# EAGLE design SmoothiePanel (EAGLE 6.4)
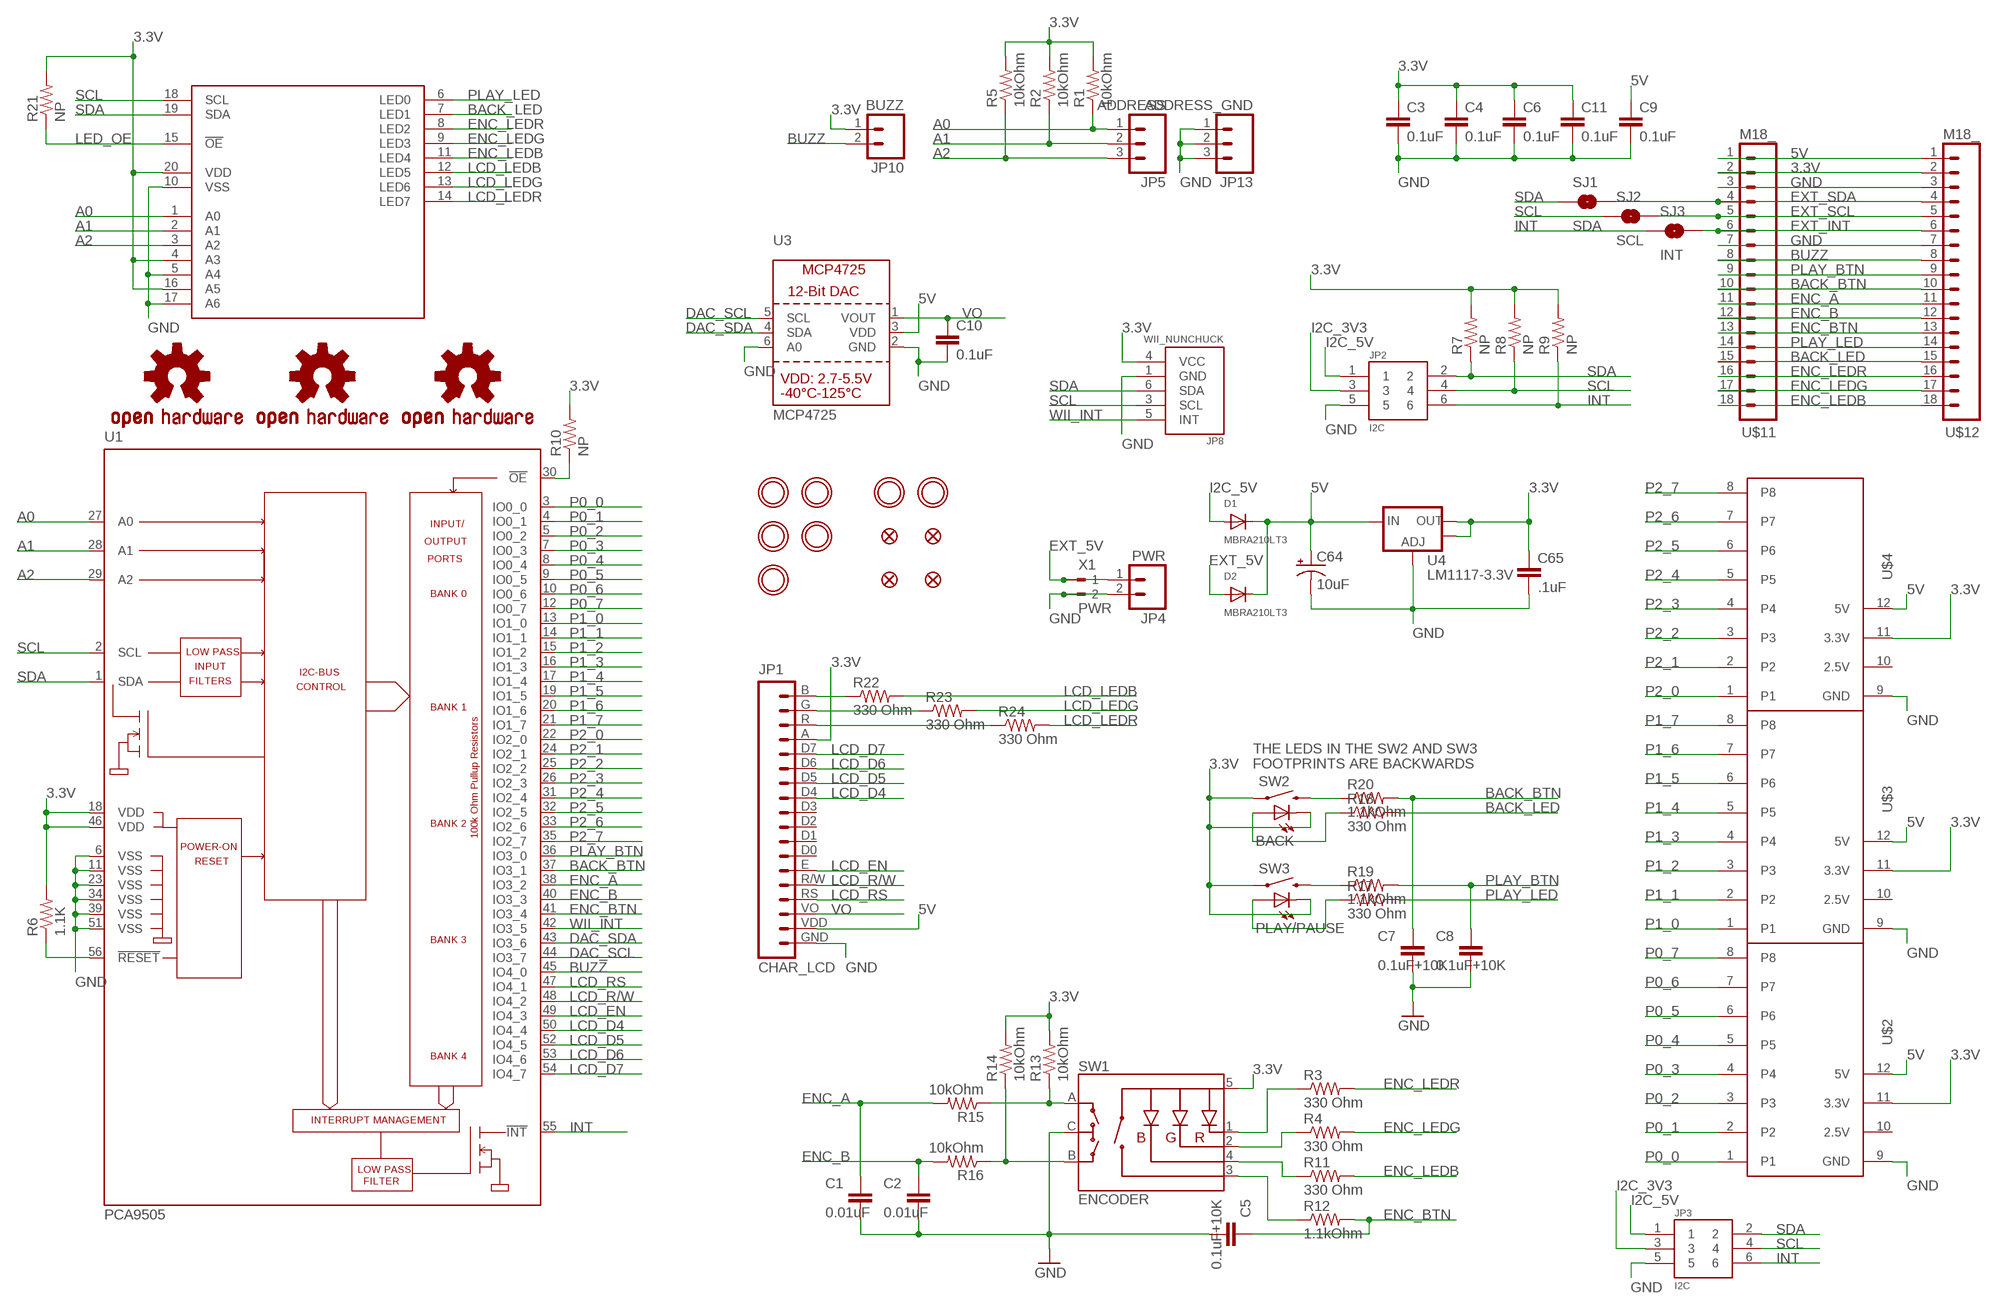
[diagram p0: schematic, sheet 1]

## Parts
C1  0.01uF  C-EUC0603  [C0603]
C2  0.01uF  C-EUC0603  [C0603]
C3  0.1uF  CAP0603-CAP  [0603-CAP]
C4  0.1uF  CAP0603-CAP  [0603-CAP]
C5  0.1uF+10K  C-EUC0603  [C0603]
C6  0.1uF  CAP0603-CAP  [0603-CAP]
C7  0.1uF+10K  C-EUC0603  [C0603]
C8  0.1uF+10K  C-EUC0603  [C0603]
C9  0.1uF  CAP0603-CAP  [0603-CAP]
C10  0.1uF  CAP0603-CAP  [0603-CAP]
C11  0.1uF  CAP0603-CAP  [0603-CAP]
C64  10uF  CAP_POL1206  [EIA3216]
C65  .1uF  C-EUC0603  [C0603]
D1  MBRA210LT3  DIODESMA  [SMADIODE]
D2  MBRA210LT3  DIODESMA  [SMADIODE]
JP1  CHAR_LCD  LCD_TEXT  [TEXT_LCD]
JP2  I2C  M03X2  [2X3-SHROUDED]
JP3  I2C  M03X2  [2X3-SHROUDED]
JP4  PWR  M02PTH3  [1X02_LONGPADS]
JP5  ADDRESS  M03PTH  [1X03]
JP8  WII_NUNCHUCK  [WII_NUNCHUCK]
JP9  FIDUCIAL1X2  [FIDUCIAL-1X2]
JP10  BUZZ  M02PTH4  [1X02_XTRA_BIG]
JP11  FIDUCIAL1X2  [FIDUCIAL-1X2]
JP12  FIDUCIAL1X2  [FIDUCIAL-1X2]
JP13  ADDRESS_GND  M03PTH  [1X03]
JP14  FIDUCIAL1X2  [FIDUCIAL-1X2]
R1  10kOhm  R-US_R0603  [R0603]
R2  10kOhm  R-US_R0603  [R0603]
R3  330 Ohm  R-US_R0603  [R0603]
R4  330 Ohm  R-US_R0603  [R0603]
R5  10kOhm  R-US_R0603  [R0603]
R6  1.1K  R-US_R0603  [R0603]
R7  NP  R-US_R0603  [R0603]
R8  NP  R-US_R0603  [R0603]
R9  NP  R-US_R0603  [R0603]
R10  NP  R-US_R0603  [R0603]
R11  330 Ohm  R-US_R0603  [R0603]
R12  1.1kOhm  R-US_R0603  [R0603]
R13  10kOhm  R-US_R0603  [R0603]
R14  10kOhm  R-US_R0603  [R0603]
R15  10kOhm  R-US_R0603  [R0603]
R16  10kOhm  R-US_R0603  [R0603]
R17  330 Ohm  R-US_R0603  [R0603]
R18  330 Ohm  R-US_R0603  [R0603]
R19  1.1kOhm  R-US_R0603  [R0603]
R20  1.1kOhm  R-US_R0603  [R0603]
R21  NP  R-US_R0603  [R0603]
R22  330 Ohm  R-US_R0603  [R0603]
R23  330 Ohm  R-US_R0603  [R0603]
R24  330 Ohm  R-US_R0603  [R0603]
SJ1  SDA  SOLDERJUMPERNO  [SJ_2S-NO]
SJ2  SCL  SOLDERJUMPERNO  [SJ_2S-NO]
SJ3  INT  SOLDERJUMPERNO  [SJ_2S-NO]
SW1  ENCODER  ENCODER_RGB_CA  [ENCODER_LED_3]
SW2  BACK  SWITCH-MOMENTARY-LEDPTH  [TACTILE-PTH-LED-12MM]
SW3  PLAY/PAUSE  SWITCH-MOMENTARY-LEDPTH  [TACTILE-PTH-LED-12MM]
U1  PCA9505  [TSSOP56-6]
U2  PCA9634-TSSOP20  [TSSOP20]
U3  MCP4725  DAC_MCP4725  [SOT23-6]
U4  LM1117-3.3V  V_REG_LM1117SOT223  [SOT223]
U$1  OSHW-LOGOL  [OSHW-LOGO-L]
U$2  PAPILIO-WING-8BITS  [PAPILIO-WING-8BITS]
U$3  PAPILIO-WING-8BITS  [PAPILIO-WING-8BITS]
U$4  PAPILIO-WING-8BITS  [PAPILIO-WING-8BITS]
U$5  MOUNTINGHOLE3.0THIN  [MOUNTINGHOLE_3.0_PLATEDTHIN]
U$6  MOUNTINGHOLE2.5_THICK  [MOUNTINGHOLE_2.5_PLATED_THICK]
U$7  MOUNTINGHOLE2.5_THICK  [MOUNTINGHOLE_2.5_PLATED_THICK]
U$8  OSHW-LOGOL  [OSHW-LOGO-L]
U$9  MOUNTINGHOLE3.0THIN  [MOUNTINGHOLE_3.0_PLATEDTHIN]
U$10  OSHW-LOGOL  [OSHW-LOGO-L]
U$11  M18_  [1X18]
U$12  M18_  [1X18]
U$13  MOUNTINGHOLE3.0THIN  [MOUNTINGHOLE_3.0_PLATEDTHIN]
U$14  MOUNTINGHOLE3.0THIN  [MOUNTINGHOLE_3.0_PLATEDTHIN]
U$15  MOUNTINGHOLE3.0THIN  [MOUNTINGHOLE_3.0_PLATEDTHIN]
X1  PWR  180-2  [180-2]

## Nets
3.3V: C3.1 C4.1 C6.1 C11.1 C65.1 JP1.A JP8.4(VCC) JP10.1 R1.2 R2.2 R5.2 R6.2 R7.2 R8.2 R9.2 R10.2 R13.2 R14.2 R21.2 SW1.5(+) SW2.4 SW2.C SW3.4 SW3.C U1.18(VDD) U1.46(VDD) U2.4(A3) U2.16(A5) U2.20(VDD) U4.2(OUT) U4.4(OUT) U$2.11(3.3V) U$3.11(3.3V) U$4.11(3.3V) U$11.2 U$12.2
5V: C9.1 C64.A(+) D1.C D2.C JP1.VDD U3.3(VDD) U4.3(IN) U$2.12(5V) U$3.12(5V) U$4.12(5V) U$11.1 U$12.1
A0: JP5.1 R1.1 U1.27(A0) U2.1(A0)
A1: JP5.2 R2.1 U1.28(A1) U2.2(A1)
A2: JP5.3 R5.1 U1.29(A2) U2.3(A2)
BACK_BTN: C7.1 R20.2 U1.37(IO3_1) U$11.10 U$12.10
BACK_BTN_RES: R20.1 SW2.2
BACK_LED: R18.2 U2.7(LED1) U$11.15 U$12.15
BACK_LED_RES: R18.1 SW2.A
BUZZ: JP10.2 U1.45(IO4_0) U$11.8 U$12.8
DAC_SCL: U1.44(IO3_7) U3.5(SCL)
DAC_SDA: U1.43(IO3_6) U3.4(SDA)
ENC_A: C1.1 R15.2 U1.38(IO3_2) U$11.11 U$12.11
ENC_A_RES: R13.1 R15.1 SW1.A
ENC_B: C2.1 R16.2 U1.40(IO3_3) U$11.12 U$12.12
ENC_B_RES: R14.1 R16.1 SW1.B
ENC_BTN: C5.1 R12.2 U1.41(IO3_4) U$11.13 U$12.13
ENC_BTN_RES: R12.1 SW1.3(SW)
ENC_LEDB: R11.2 U2.11(LED4) U$11.18 U$12.18
ENC_LEDB_RES: R11.1 SW1.4(-B)
ENC_LEDG: R4.2 U2.9(LED3) U$11.17 U$12.17
ENC_LEDG_RES: R4.1 SW1.2(-G)
ENC_LEDR: R3.2 U2.8(LED2) U$11.16 U$12.16
ENC_LEDR_RES: R3.1 SW1.1(-R)
EXT_5V: D2.A JP4.1 X1.1
EXT_INT: SJ3.2 U$11.6 U$12.6
EXT_SCL: SJ2.2 U$11.5 U$12.5
EXT_SDA: SJ1.2 U$11.4 U$12.4
GND: C1.2 C2.2 C3.2 C4.2 C5.2 C6.2 C7.2 C8.2 C9.2 C10.2 C11.2 C64.C(-) C65.2 JP1.GND JP2.5 JP3.5 JP4.2 JP8.1(GND) JP13.1 JP13.2 JP13.3 SW1.C U1.6(VSS) U1.11(VSS) U1.23(VSS) U1.34(VSS) U1.39(VSS) U1.51(VSS) U2.5(A4) U2.10(VSS) U2.17(A6) U3.2(GND) U3.6(A0) U4.1(ADJ) U$2.9(GND) U$3.9(GND) U$4.9(GND) U$11.3 U$11.7 U$12.3 U$12.7 X1.2
I2C_3V3: JP2.3 JP3.3
I2C_5V: D1.A JP2.1 JP3.1
INT: JP2.6 JP3.6 R9.1 SJ3.1 U1.55(!INT)
LCD_D4: JP1.D4 U1.50(IO4_4)
LCD_D5: JP1.D5 U1.52(IO4_5)
LCD_D6: JP1.D6 U1.53(IO4_6)
LCD_D7: JP1.D7 U1.54(IO4_7)
LCD_EN: JP1.E U1.49(IO4_3)
LCD_LEDB: R22.2 U2.12(LED5)
LCD_LEDB_RES: JP1.B R22.1
LCD_LEDG: R23.2 U2.13(LED6)
LCD_LEDG_RES: JP1.G R23.1
LCD_LEDR: R24.2 U2.14(LED7)
LCD_LEDR_RES: JP1.R R24.1
LCD_R/W: JP1.R/W U1.48(IO4_2)
LCD_RS: JP1.RS U1.47(IO4_1)
LED_OE: R21.1 U2.15(!OE!)
OE: R10.1 U1.30(!OE)
P0_0: U1.3(IO0_0) U$2.1
P0_1: U1.4(IO0_1) U$2.2
P0_2: U1.5(IO0_2) U$2.3
P0_3: U1.7(IO0_3) U$2.4
P0_4: U1.8(IO0_4) U$2.5
P0_5: U1.9(IO0_5) U$2.6
P0_6: U1.10(IO0_6) U$2.7
P0_7: U1.12(IO0_7) U$2.8
P1_0: U1.13(IO1_0) U$3.1
P1_1: U1.14(IO1_1) U$3.2
P1_2: U1.15(IO1_2) U$3.3
P1_3: U1.16(IO1_3) U$3.4
P1_4: U1.17(IO1_4) U$3.5
P1_5: U1.19(IO1_5) U$3.6
P1_6: U1.20(IO1_6) U$3.7
P1_7: U1.21(IO1_7) U$3.8
P2_0: U1.22(IO2_0) U$4.1
P2_1: U1.24(IO2_1) U$4.2
P2_2: U1.25(IO2_2) U$4.3
P2_3: U1.26(IO2_3) U$4.4
P2_4: U1.31(IO2_4) U$4.5
P2_5: U1.32(IO2_5) U$4.6
P2_6: U1.33(IO2_6) U$4.7
P2_7: U1.35(IO2_7) U$4.8
PLAY_BTN: C8.1 R19.2 U1.36(IO3_0) U$11.9 U$12.9
PLAY_BTN_RES: R19.1 SW3.2
PLAY_LED: R17.2 U2.6(LED0) U$11.14 U$12.14
PLAY_LED_RES: R17.1 SW3.A
RESET: R6.1 U1.56(!RESET)
SCL: JP2.4 JP3.4 JP8.3(SCL) R8.1 SJ2.1 U1.2(SCL) U2.18(SCL)
SDA: JP2.2 JP3.2 JP8.6(SDA) R7.1 SJ1.1 U1.1(SDA) U2.19(SDA)
VO: C10.1 JP1.VO U3.1(VOUT)
WII_INT: JP8.5(INT) U1.42(IO3_5)
Unconnected: JP1.D0 JP1.D1 JP1.D2 JP1.D3 U$2.10(2.5V) U$3.10(2.5V) U$4.10(2.5V)

## Notes on the sheet
- THE LEDS IN THE SW2 AND SW3
  FOOTPRINTS ARE BACKWARDS

## Library data of the parts
C1 C2 C5 C7 C8 = rcl:C-EU: CAPACITOR, European symbol
C3 C4 C6 C9-C11 = SparkFun-Capacitors:CAP: Capacitor Standard 0603 ceramic capacitor, and 0.1" leaded capacitor.
C64 = SparkFun:CAP_POL: Capacitor Polarized These are standard SMD and PTH capacitors. Normally 10uF, 47uF, and 100uF in electrolytic and tantalum varieties. Always verify the external diameter of the through hole cap, it varies with capacity, voltage, and manufacturer. The EIA devices should be standard.
C65 = resistor:C-EU: CAPACITOR, European symbol
D1 D2 = microbuilder:DIODE: Diode SMADIODE - SMA Surface Mount Package 20V 1A Schottky Diode Digikey (500mV @ 1A, 500uA Vr @ 20V): 641-1014-6-ND 10V 2A Schottky Diode Digikey (350mV @ 2A, 700uA Vr @ 10V): MBRA210LT3 SOD-123 30V 200mA (800mV Vf, 2uA Vr @ 25V) Schottky Diode (very fast switching for boost, etc.) - Digikey: BAT54T1GOSTR-ND 30V 500mA (430mV Vf, 130uA Vr @ 30V) Schottky Diode - Digikey: B0530W-FDICT-ND MBR120 1A 20V (0.34Vf) Schottky Diode - Digikey: MBR120VLSFT1GOSCT-ND SOD-323 10V 570mA (380mV Vf, 3ns) Schottky Diode - Digikey: ZLLS410CT-ND 1N4148WS - 75V 150mA (1V Vf @ 10mA, 4ns) Simple Diode - Digikey: 1N4148WSFSCT-ND, Mouser: 512-1N4148WS SOD-523 BAT54 30V 200mA Schottky (0.8 Vf @ 100mA, 5ns) - Digikey: BAT54XV2CT-ND 30V 30mA Schottky Diode (RB751S-40TE61) - Digikey: RB751S-40TE61CT-ND SOT23-R/W - SOT23 Package (R = Solder Paste/Reflow Ovens, W = Hand-Soldering) BAT54Film 40V 300mA - Digikey: 497-7162-1-ND DO-1N4148 Through Hole Small Current Diode (any model)
JP1 = logxen:LCD_TEXT
JP2 JP3 = SparkFun-Connectors:M03X2: Shrouded 2x3 .1" header, with keying.
JP4 JP10 = SparkFun-Connectors:M02: Header 2 Standard 2-pin 0.1" header. Use with straight break away headers (SKU : PRT-00116), right angle break away headers (PRT-00553), swiss pins (PRT-00743), machine pins (PRT-00117), and female headers (PRT-00115). Molex polarized connector foot print use with SKU : PRT-08233 with associated crimp pins and housings.
JP5 JP13 = SparkFun-Connectors:M03: Header 3 Standard 3-pin 0.1" header. Use with straight break away headers (SKU : PRT-00116), right angle break away headers (PRT-00553), swiss pins (PRT-00743), machine pins (PRT-00117), and female headers (PRT-00115). Molex polarized connector foot print use with SKU : PRT-08232 with associated crimp pins and housings.
JP8 = logxen:WII_NUNCHUCK
JP9 JP11 JP12 JP14 = SparkFun:FIDUCIAL: Fiducial Alignment Points Various fiducial points for machine vision alignment.
R1-R24 = resistor:R-US_: RESISTOR, American symbol
SJ1-SJ3 = SparkFun-Passives:SOLDERJUMPER: Solder Jumper Standard SMD solder jumper. Used to automate production. Two varients : Normally Open and Normally Closed are the same, but have different paste layers. NC will have a large amount of paste and should jumper during reflow.
SW1 = SparkFun:ENCODER_RGB_CA: Illuminated Rotary Encoder w/ RGB LED and select switch EC12PLRGBSDVBF-D: http://top-up.so-buy.com/front/bin/ptdetail.phtml?Part=EC12PLRGBSDVBF-D
SW2 SW3 = Local Library:SWITCH-MOMENTARY-LED
U1 = micro-philips:PCA9505: 40-bit I2C-bus I/O port with /RESET, /OE and /INT The 9505 has 100k ohm pull-ups on IO pins. Source: http://www.nxp.com/acrobat_download/datasheets/PCA9505_9506_3.pdf; MPN: PCA9505DGG,118; OC_FARNELL: unknown; OC_NEWARK: 70R6450
U2 = logxen:PCA9634
U3 = microbuilder:DAC_MCP4725: MCP4725 - 12-Bit I2C DAC with on-board EEPROM Settling Time: 6 µs 2.7-5.5V Supply 100kHz, 400kHz, 3.4 Mbps I²C EEPROM can be used to store a specific output voltage which will be set coming out of reset I²C Address: 1100 A2 A1 A0 A0 is set via the A0 pin, A2 and A1 are hard-wired on the chip depending on the model chosen: Part Number A2 A1 Code MCP4725A0T-E/CH 0 0 AJNN MCP4725A1T-E/CH 0 1 APNN MCP4725A2T-E/CH 1 0 AQNN MCP4725A3T-E/CH 1 1 ARNN
U4 = SparkFun:V_REG_LM1117: Voltage Regulator LM1117 Standard adjustable voltage regulator but in SMD form. Spark Fun Electronics SKU : COM-00595
U$1 U$8 U$10 = SparkFun-Aesthetics:OSHW-LOGO: Open Source Hardware Logo This logo indicates the piece of hardware it is found on incorporates a OSHW license and/or adheres to the definition of open source hardware found here: http://freedomdefined.org/OSHW
U$2-U$4 = logxen:PAPILIO-WING-8BITS
U$5-U$7 U$9 U$13-U$15 = microbuilder:MOUNTINGHOLE: Mounting Hole For #2 screws (0.086"/2.18mm width, 0.094"/2.4mm hole) use 2.5mm
U$11 U$12 = SparkFun-Connectors:M18: 1x18 .1" header
X1 = con-weidmueller-sl35:180-2: WEIDMUELLER CLAMP CONNECTOR; OC_FARNELL: unknown; OC_NEWARK: unknown

## Board
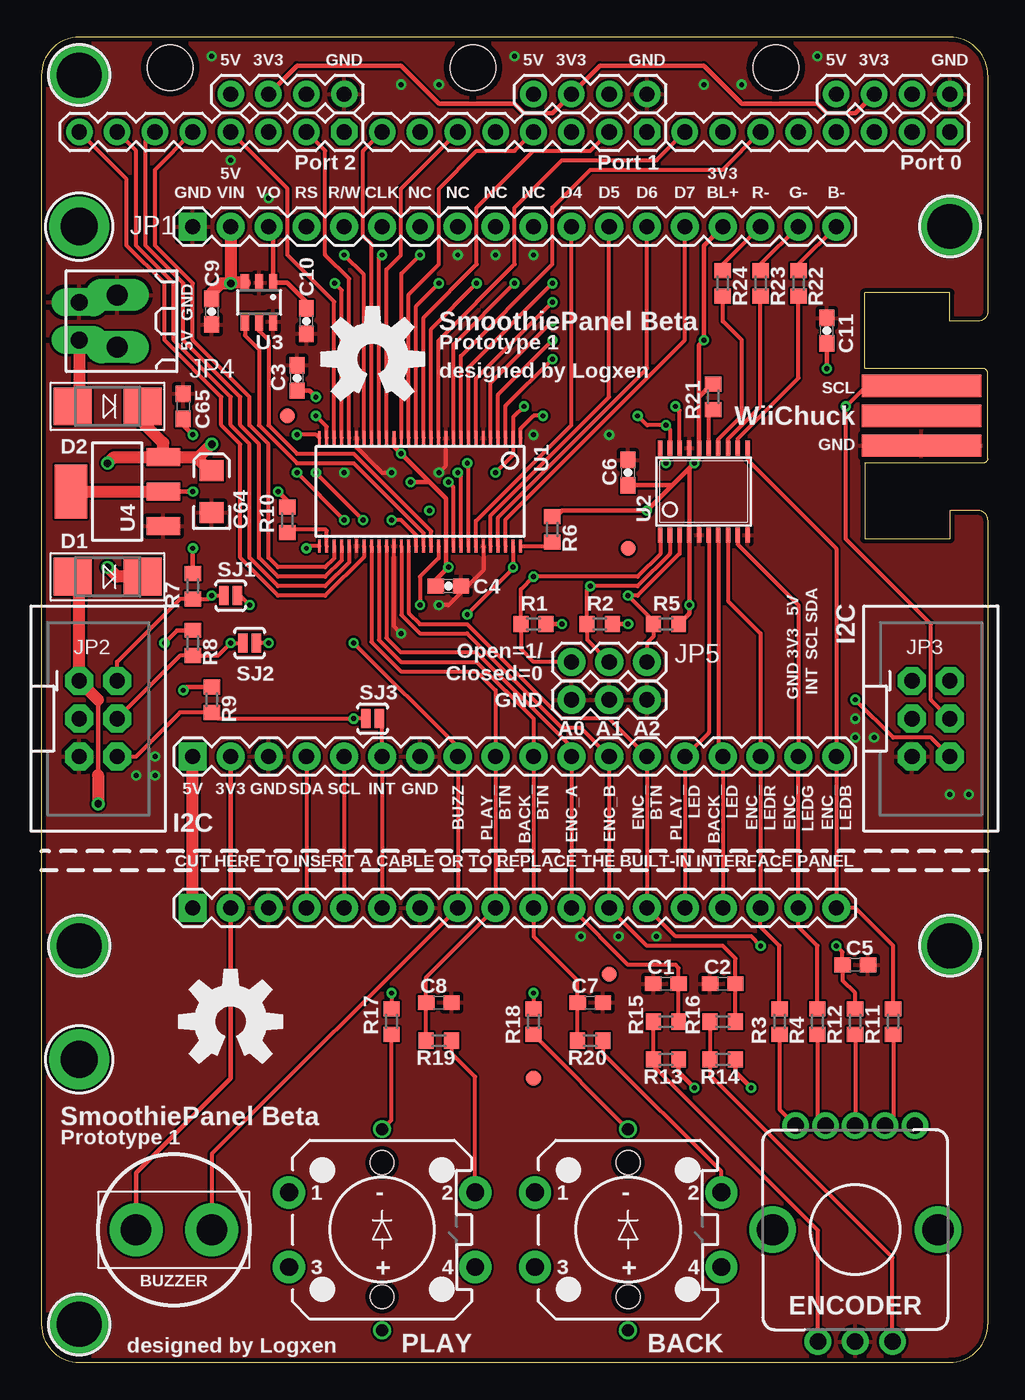
[diagram p1: board, top side]
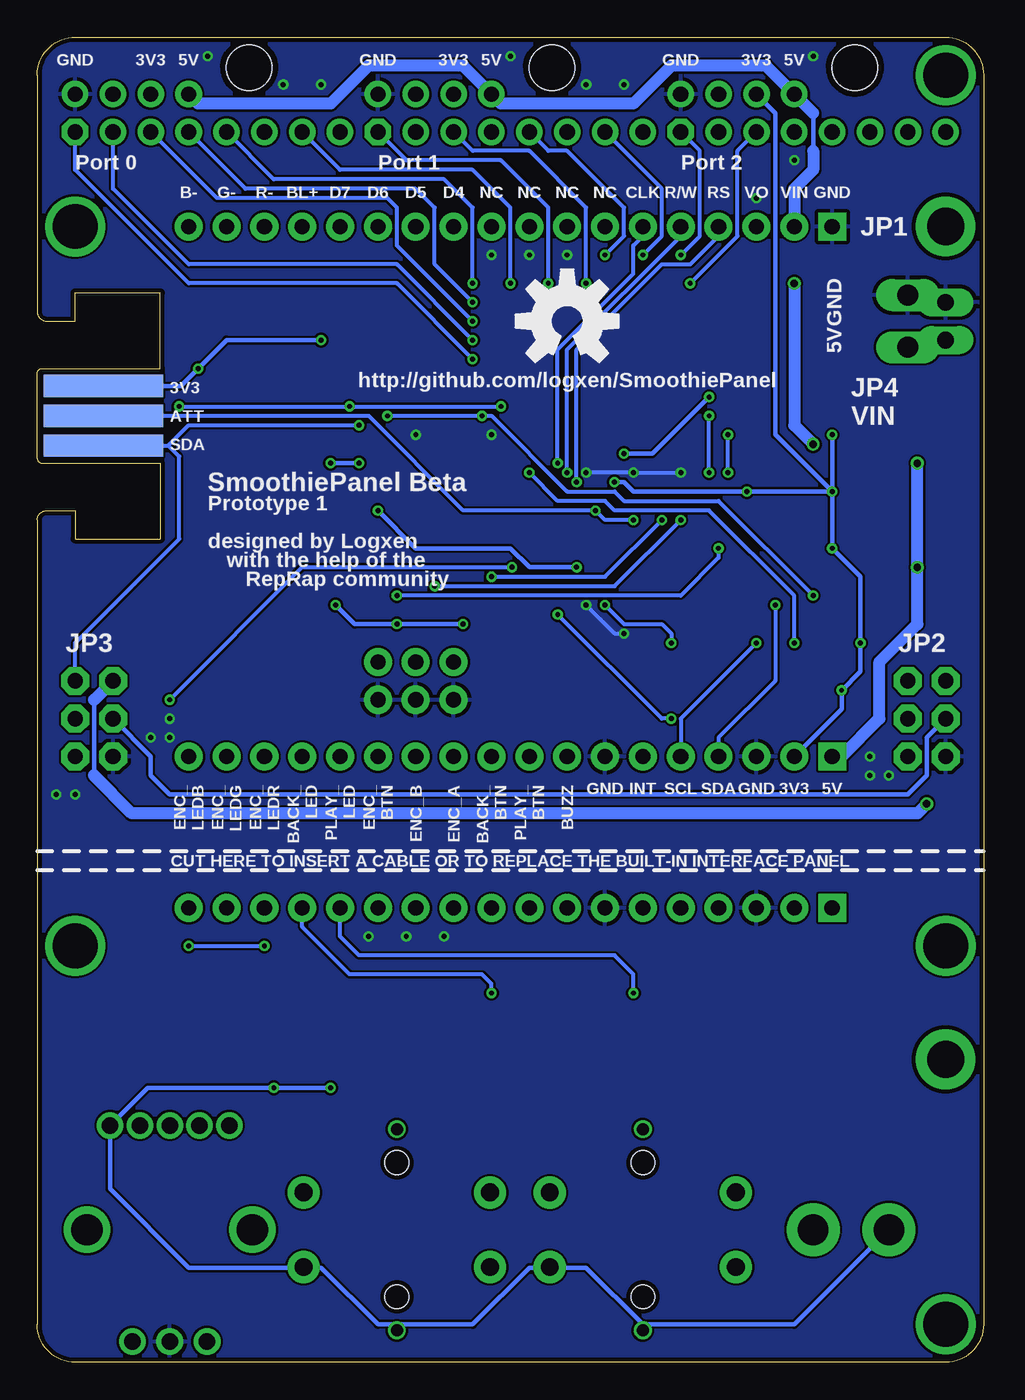
[diagram p2: board, bottom side, seen from below]

Size 63.5 x 88.9 mm. Coordinates in mm from the lower left corner, seen from the top.
Outline: 63.5,70.48 63.5,86.36 arc90 60.96,88.9 2.54,88.9 arc90 0,86.36 0,2.54 arc90 2.54,0 60.96,0 arc90 63.5,2.54 63.5,56.52
Copper layers (1*16): Top 0.0356mm / dielectric 1.5011mm / Bottom 0.0356mm
Design rules "LaenPCBOrder *": minimum track width 6mil, minimum drill 13mil, track to track 6mil, track to pad 6mil, pad to pad 6mil, via to via 6mil, smd to smd 6mil, copper to edge 12mil, drill to drill 6mil, minimum pad ring 7mil, minimum via ring 7mil, stop-mask expansion 4mil, vias tented up to drill 0mil, thermal gap 10mil

### Footprints (pad centres in the part's own frame; a part is rotated, then mirrored left to right if it is on the bottom)
C0603 = smd 1.1 x 1: 1 -0.85,0; 2 0.85,0
0603-CAP = smd 1.1 x 1: 1 -0.85,0; 2 0.85,0
EIA3216 = smd 1.4 x 1.6: A 1.4,0; C -1.4,0
SMADIODE = smd 2.54 x 2.54: A 2.349,0; C -2.349,0
TEXT_LCD = drill 1.016 pad 1.88: A 35.56,0; B 43.18,0; D0 15.24,0; D1 17.78,0; D2 20.32,0; D3 22.86,0; D4 25.4,0; D5 27.94,0; D6 30.48,0; D7 33.02,0; E 12.7,0; G 40.64,0; R 38.1,0; R/W 10.16,0; RS 7.62,0; VDD 2.54,0; VO 5.08,0 | drill 1.016 pad 1.88 square: GND 0,0
2X3-SHROUDED = drill 1.016 pad 1.88 octagon: 1 -1.27,2.54; 2 1.27,2.54; 3 -1.27,0; 4 1.27,0; 5 -1.27,-2.54; 6 1.27,-2.54
1X02_LONGPADS = drill 1.118 pad 1.88 long: 1 0,0; 2 2.54,0
1X03 = drill 1.016 pad 1.88: 1 0,0; 2 2.54,0; 3 5.08,0
WII_NUNCHUCK = smd 8 x 1.5: 1 4.445,2; 2 4.445,0; 3 4.445,-2 | smd 8 x 1.5 bottom: 4 4.445,-2; 5 4.445,0; 6 4.445,2
FIDUCIAL-1X2 = smd 1 x 1: 1 0,0
1X02_XTRA_BIG = drill 2.057 pad 3.556: 1 -2.54,0; 2 2.54,0
R0603 = smd 1 x 1.1: 1 -0.85,0; 2 0.85,0
SJ_2S-NO = smd 0.635 x 1.27: 1 -0.45,0; 2 0.45,0
ENCODER_LED_3 = drill 1.1 pad 1.778: 1 -4,7; 2 -2,7; 3 0,7; 4 2,7; 5 4,7 | drill 1.1 pad 1.8: A -2.5,-7.5; B 2.5,-7.5; C 0,-7.5 | drill 2.1: M1 -5.55,0; M2 5.55,0
TACTILE-PTH-LED-12MM = drill 1.2 pad 2.159: 1 -6.25,2.5; 2 6.25,2.5; 3 -6.25,-2.5; 4 6.25,-2.5 | drill 0.8: A 0,6.75; C 0,-6.75 | hole 1.6: 0,4.5; 0,-4.5
TSSOP56-6 = smd 0.2 x 0.9: 1 -6.75,-3.6; 2 -6.25,-3.6; 3 -5.75,-3.6; 4 -5.25,-3.6; 5 -4.75,-3.6; 6 -4.25,-3.6; 7 -3.75,-3.6; 8 -3.25,-3.6; 9 -2.75,-3.6; 10 -2.25,-3.6; 11 -1.75,-3.6; 12 -1.25,-3.6; 13 -0.75,-3.6; 14 -0.25,-3.6; 15 0.25,-3.6; 16 0.75,-3.6; 17 1.25,-3.6; 18 1.75,-3.6; 19 2.25,-3.6; 20 2.75,-3.6; 21 3.25,-3.6; 22 3.75,-3.6; 23 4.25,-3.6; 24 4.75,-3.6; 25 5.25,-3.6; 26 5.75,-3.6; 27 6.25,-3.6; 28 6.75,-3.6; 29 6.75,3.66; 30 6.25,3.66; 31 5.75,3.66; 32 5.25,3.66; 33 4.75,3.66; 34 4.25,3.66; 35 3.75,3.66; 36 3.25,3.66; 37 2.75,3.66; 38 2.25,3.66; 39 1.75,3.66; 40 1.25,3.66; 41 0.75,3.66; 42 0.25,3.66; 43 -0.25,3.66; 44 -0.75,3.66; 45 -1.25,3.66; 46 -1.75,3.66; 47 -2.25,3.66; 48 -2.75,3.66; 49 -3.25,3.66; 50 -3.75,3.66; 51 -4.25,3.66; 52 -4.75,3.66; 53 -5.25,3.66; 54 -5.75,3.66; 55 -6.25,3.66; 56 -6.75,3.66
TSSOP20 = smd 0.305 x 0.991: 1 -2.925,-2.918; 2 -2.275,-2.918; 3 -1.625,-2.918; 4 -0.975,-2.918; 5 -0.325,-2.918; 6 0.325,-2.918; 7 0.975,-2.918; 8 1.625,-2.918; 9 2.275,-2.918; 10 2.925,-2.918; 11 2.925,2.918; 12 2.275,2.918; 13 1.625,2.918; 14 0.975,2.918; 15 0.325,2.918; 16 -0.325,2.918; 17 -0.975,2.918; 18 -1.625,2.918; 19 -2.275,2.918; 20 -2.925,2.918
SOT23-6 = smd 0.55 x 1.2: 1 -0.95,-1.3; 2 0,-1.3; 3 0.95,-1.3; 4 0.95,1.3; 5 0,1.3; 6 -0.95,1.3
SOT223 = smd 1.219 x 2.235: 1 -2.311,-3.099; 2 0,-3.099; 3 2.311,-3.099 | smd 3.6 x 2.2: 4 0,3.099
PAPILIO-WING-8BITS = drill 1.016 pad 1.778 octagon: 1 0,0 | drill 1.016 pad 1.778: 2 0,2.54; 3 0,5.08; 4 0,7.62; 5 0,10.16; 6 0,12.7; 7 0,15.24; 8 0,17.78; 9 2.54,0; 10 2.54,2.54; 11 2.54,5.08; 12 2.54,7.62 | hole 3.048: 4.318,11.684
MOUNTINGHOLE_3.0_PLATEDTHIN = drill 3 pad 3.6: P$1 0,0
MOUNTINGHOLE_2.5_PLATED_THICK = drill 2.5 pad 4: P$1 0,0
1X18 = drill 1.016 pad 1.88 square: 1 0,0 | drill 1.016 pad 1.88: 2 2.54,0; 3 5.08,0; 4 7.62,0; 5 10.16,0; 6 12.7,0; 7 15.24,0; 8 17.78,0; 9 20.32,0; 10 22.86,0; 11 25.4,0; 12 27.94,0; 13 30.48,0; 14 33.02,0; 15 35.56,0; 16 38.1,0; 17 40.64,0; 18 43.18,0
180-2 = drill 1.422 long: 1 -1.75,0; 2 1.75,0

### Placement (x,y rotation side)
C1  41.91,25.4 180 top
C2  45.72,25.4 180 top
C3  17.14,66.04 90 top
C4  27.3,52.07 0 top
C5  54.61,26.67 0 top
C6  39.37,59.69 90 top
C7  36.83,24.13 0 top
C8  26.67,24.13 0 top
C9  11.43,70.48 270 top
C10  17.78,69.85 270 top
C11  52.7,69.22 90 top
C64  11.43,58.42 90 top
C65  9.53,64.14 90 top
D1  4.45,52.7 180 top
D2  4.45,64.14 180 top
JP1  10.16,76.2 0 top
JP2  3.81,43.18 0 top
JP3  59.69,43.18 0 top
JP4  2.54,68.58 90 top
JP5  35.56,46.99 0 top
JP8  63.5,63.5 180 top
JP9  33.02,19.05 0 top
JP10  8.89,8.89 0 top
JP11  39.37,54.61 0 top
JP12  38.1,26.04 0 top
JP13  35.56,44.45 0 top
JP14  16.51,63.5 0 top
R1  33.02,49.53 0 top
R2  37.47,49.53 0 top
R3  49.53,22.86 90 top
R4  52.07,22.86 90 top
R5  41.91,49.53 0 top
R6  34.29,55.88 90 top
R7  10.16,52.07 90 top
R8  10.16,48.26 90 top
R9  11.43,44.45 90 top
R10  16.51,56.52 90 top
R11  57.15,22.86 90 top
R12  54.61,22.86 90 top
R13  41.91,20.32 0 top
R14  45.72,20.32 0 top
R15  41.91,22.86 0 top
R16  45.72,22.86 0 top
R17  23.5,22.86 90 top
R18  33.02,22.86 90 top
R19  26.67,21.59 180 top
R20  36.83,21.59 180 top
R21  45.09,64.77 90 top
R22  50.8,72.39 270 top
R23  48.26,72.39 270 top
R24  45.72,72.39 270 top
SJ1  12.7,51.44 0 top
SJ2  13.97,48.26 0 top
SJ3  22.23,43.18 0 top
SW1  54.61,8.89 0 top
SW2  39.37,8.89 0 top
SW3  22.86,8.89 0 top
U1  25.4,58.42 180 top
U2  44.45,58.42 0 top
U3  14.61,71.12 180 top
U4  5.08,58.42 90 top
U$1  12.7,22.86 0 top
U$2  60.96,82.55 90 top
U$3  40.64,82.55 90 top
U$4  20.32,82.55 90 top
U$5  60.96,76.2 0 top
U$6  2.54,20.32 0 top
U$7  2.54,76.2 0 top
U$8  22.23,67.31 0 top
U$9  2.54,27.94 0 top
U$10  27.94,69.85 0 bottom
U$11  10.16,40.64 0 top
U$12  10.16,30.48 0 top
U$13  2.54,86.36 0 top
U$14  2.54,2.54 0 top
U$15  60.96,27.94 0 top
X1  5.08,69.85 90 top

### Tracks (layer width: path | path; a pad name or v marks a point on that pad's centre or on a via)
3.3V  (via drill 0.33)
  Top 0.254: 43.48,59.98 v43.81,60.33 | 27.15,53.49 v27.3,53.34 | 9.74,45.3 v9.53,45.09 | 9.11,49.11 v8.26,48.26
  Top 0.305: 44.12,64.77 U2.16 44.12,60.63 v43.81,60.33 42.33,58.84 | 44.12,64.77 44.12,68.25 v44.45,68.58 44.45,74.93 JP1.A | R13.2 42.76,19.47 v43.81,18.41 | R14.2 46.57,19.47 v47.62,18.41 | R8.2 9.11,49.11 | R9.2 9.74,45.3 | 43.48,59.98 U2.4 v43.48,50.8 43.48,50.24 R5.2 | U2.20 41.52,60.71 v41.91,60.33 | 42.33,58.84 v40.64,57.15 34.92,57.15 34.51,56.73 R6.2 | 27.15,53.49 U1.46 27.15,57.94 26.04,59.05 | 26.04,59.05 v24.13,60.96 23.65,61.44 U1.18 | v24.77,59.05 26.04,59.05 | R1.2 v34.92,49.53 | v39.37,49.53 R2.2 | C11.1 v52.7,66.67 | C6.1 42.33,58.84 | C4.1 26.45,52.49 v27.3,53.34 | C3.1 18,65.19 v18.41,64.77 | U$11.2 U$12.2 12.7,19.05 6.35,12.7 JP10.1 | U$4.11 17.14,87 24.13,87 26.67,84.45 31.75,84.45 32.38,83.82 34.29,83.82 U$3.11 37.47,87 44.45,87 46.99,84.45 52.07,84.45 52.7,83.82 54.61,83.82 U$2.11 | R7.2 v10.16,54.61 | R10.2 16.51,57.78 v15.88,58.42 | U4.2 v10.16,58.42 | C65.1 9.53,62.87 v10.16,62.23 | R21.2 44.98,65.62 44.12,64.77
  Top 0.813: U4.4 U4.2
  Bottom 0.254: 22.86,2.54 SW3.C 22.46,2.54 | 45.58,6.35 SW2.4
  Bottom 0.305: SW2.4 45.66,6.35 53.34,6.35 58.61,11.62 SW1.5 56.09,18.41 v47.62,18.41 v43.81,18.41 | 22.86,2.54 26.67,6.35 29.07,6.35 SW3.4 29.15,6.35 30.48,6.35 34.29,2.54 38.97,2.54 | 39.77,2.54 SW2.C 38.97,2.54 | 39.77,2.54 40.64,2.54 44.45,6.35 45.58,6.35 | JP10.1 12.7,2.54 22.46,2.54 | JP8.4 53.88,65.5 v52.7,66.67 50.8,68.58 v44.45,68.58 | v41.91,60.33 v43.81,60.33 | v27.3,53.34 30.48,53.34 31.75,54.61 38.1,54.61 v40.64,57.15 | v10.16,58.42 v15.88,58.42 23.5,58.42 24.13,59.05 v24.77,59.05 | v34.92,49.53 v39.37,49.53 42.2,49.53 v43.48,50.8 | v24.13,60.96 22.23,60.96 v18.41,64.77 | 38.97,2.54 39.77,2.54 | v10.16,58.42 13.97,62.23 13.97,83.82 U$4.11 | U$11.2 9.53,43.81 v9.53,45.09 8.26,46.35 v8.26,48.26 8.26,52.7 v10.16,54.61 v10.16,58.42 | v10.16,62.23 v10.16,58.42
5V  (via drill 0.5)
  Top 0.254: 12.73,72.42 v12.7,72.39
  Top 0.813: C9.1 11.43,71.75 12.06,72.39 v12.7,72.39 JP1.VDD | U3.3 12.73,72.42 | U$12.1 U$11.1 | U4.3 8.18,61.67 6.79,63.06 D2.C | U4.3 10.39,60.73 | C64.A 11.3,59.82 10.39,60.73 | v11.43,61.59 10.57,60.73 10.39,60.73 | v4.45,53.34 5.08,52.7 D1.C | v4.45,60.33 4.85,60.73 U4.3
  Bottom 0.305: 11.43,83.82 11.43,81.28
  Bottom 0.813: v12.7,72.39 12.7,62.87 v11.43,61.59 | 11.43,83.82 U$4.12 14.61,87 20.95,87 23.5,84.45 32.38,84.45 U$3.12 34.92,87 41.27,87 43.81,84.45 52.7,84.45 U$2.12 | 11.43,81.28 11.43,80.01 12.7,78.74 JP1.VDD | v4.45,60.33 v4.45,53.34 4.45,49.53 6.99,46.99 6.99,43.18 9.53,40.64 U$11.1
A0  (via drill 0.33)
  Top 0.254: U2.1 41.52,54.23 40.01,52.7 v33.02,52.7 32.17,51.85 R1.1 32.17,47.84 33.02,46.99 JP5.1 | v21.59,56.52 v18.41,59.69 | U1.27 19.15,62.77 v18.41,63.5
  Bottom 0.254: v33.02,52.7 25.4,52.7 v21.59,56.52 | v18.41,59.69 v18.41,63.5
A1  (via drill 0.33)
  Top 0.254: U2.2 42.17,54.24 40.01,52.07 v36.83,52.07 36.62,51.85 R2.1 36.62,48.48 JP5.2 | v20.32,56.52 v17.14,59.69 | U1.28 18.44,62.23 v17.14,62.23
  Bottom 0.254: v36.83,52.07 24.77,52.07 v20.32,56.52 | v17.14,59.69 v17.14,62.23
A2  (via drill 0.33)
  Top 0.254: U1.29 17.93,54.76 v17.78,54.61 | U2.3 42.83,54.26 40.01,51.44 v39.37,51.44 41.06,49.74 R5.1 41.06,48.68 40.64,48.26 JP5.3
  Bottom 0.254: v17.78,54.61 17.78,53.98 20.32,51.44 v39.37,51.44
BACK_BTN
  Top 0.254: R20.2 C7.1 35.98,25.61 33.02,28.57 U$12.10 U$11.10 33.02,43.18 29.21,46.99 24.13,46.99 22.65,48.47 U1.37
BACK_BTN_RES
  Top 0.254: SW2.2 45.62,12.8 37.68,20.74 R20.1
BACK_LED  (via drill 0.33)
  Top 0.254: U2.7 45.42,40.94 U$11.15 U$12.15 | v33.02,24.77 R18.2
  Bottom 0.254: v33.02,24.77 33.02,25.4 33.66,26.04 42.55,26.04 45.72,29.21 U$12.15
BACK_LED_RES
  Top 0.254: R18.1 33.02,21.99 SW2.A
BUZZ  (via drill 0.33)
  Top 0.254: U1.45 26.65,53.95 25.4,52.7 v25.4,50.8 | v20.95,48.26 27.94,41.27 U$11.8 U$12.8 11.43,13.97 JP10.2
  Bottom 0.254: v25.4,50.8 24.13,49.53 21.59,49.53 20.95,48.9 v20.95,48.26
DAC_SCL
  Top 0.254: U1.44 26.15,55.77 20.95,60.96 17.14,60.96 15.24,62.87 15.24,68.58 14.61,69.22 U3.5
DAC_SDA
  Top 0.254: U1.43 25.65,55.63 20.95,60.33 17.14,60.33 14.61,62.87 14.61,67.94 13.65,68.89 U3.4
ENC_A
  Top 0.254: R15.2 C1.1 42.76,26.45 42.55,26.67 39.37,26.67 U$12.11 U$11.11 35.56,41.27 29.21,47.62 24.13,47.62 23.15,48.6 U1.38
ENC_A_RES
  Top 0.254: SW1.A 52.11,8.85 41.06,19.9 R13.1 R15.1
ENC_B
  Top 0.254: R16.2 C2.1 46.57,27.09 45.72,27.94 40.64,27.94 U$12.12 U$11.12 36.2,42.55 34.92,42.55 28.57,48.9 25.4,48.9 24.15,50.15 U1.40
ENC_B_RES
  Top 0.254: SW1.B 57.11,7.03 44.87,19.27 R14.1 R16.1
ENC_BTN  (via drill 0.33)
  Top 0.254: R12.2 54.61,24.77 53.76,25.61 C5.1 53.76,27.52 v53.34,27.94 | U1.41 24.65,50.28 25.4,49.53 28.57,49.53 34.92,43.18 38.1,43.18 U$11.13 U$12.13 42.55,28.57 47.62,28.57 v48.26,27.94
  Bottom 0.254: v53.34,27.94 v48.26,27.94
ENC_BTN_RES
  Top 0.254: R12.1 SW1.3
ENC_LEDB
  Top 0.254: U2.11 47.38,60.58 53.34,54.61 U$11.18 U$12.18 54.61,30.48 57.15,27.94 R11.2
ENC_LEDB_RES
  Top 0.254: R11.1 57.15,16.43 SW1.4
ENC_LEDG
  Top 0.254: U2.9 46.73,54.88 50.8,50.8 U$11.17 U$12.17 50.8,29.21 52.07,27.94 R4.2
ENC_LEDG_RES
  Top 0.254: R4.1 52.07,16.43 SW1.2
ENC_LEDR
  Top 0.254: U2.8 46.08,51.08 48.26,48.9 U$11.16 U$12.16 48.26,29.21 49.53,27.94 R3.2
ENC_LEDR_RES
  Top 0.254: R3.1 49.53,16.97 SW1.1
EXT_5V
  Top 0.813: X1.1 4.6,68.58 JP4.1 2.54,64.58 D2.A
EXT_INT
  Top 0.254: U$12.6 U$11.6 22.86,42.99 SJ3.2
EXT_SCL  (via drill 0.33)
  Top 0.254: U$11.5 U$12.5 | v15.24,48.26 SJ2.2
  Bottom 0.254: v15.24,48.26 20.32,43.18 U$11.5
EXT_SDA  (via drill 0.33)
  Top 0.254: U$11.4 U$12.4 | SJ1.2 13.34,51.44 v13.97,50.8
  Bottom 0.254: v13.97,50.8 13.97,45.72 17.78,41.91 U$11.4
GND  (via drill 0.33)
  Top 0.254: U1.23 21.15,61.4 22.86,59.69 v23.5,59.69 | v26.67,59.69 27.15,60.17 U1.11 | U1.51 29.65,53.15 27.3,50.8 v26.67,50.8 | v24.13,48.9 23.65,49.38 U1.39
  Bottom 0.254: v26.67,59.69 v23.5,59.69 v20.32,59.69 | v26.67,50.8 24.77,48.9 v24.13,48.9
  other vias: 33.02,62.23 38.1,62.23 38.73,28.57 41.27,28.57 36.2,28.57 31.75,87.63 46.99,85.72 44.45,85.72 24.13,85.72 26.67,85.72 11.43,87.63 52.07,87.63 12.7,80.64 15.24,78.11 27.94,74.3 30.48,74.3 33.02,74.3 6.35,39.37 7.62,39.37 7.62,40.64 54.61,43.18 55.88,41.91 54.61,41.91 60.96,38.1 62.23,38.1
  pour Top: -1.27,90.17 64.77,90.17 64.77,-1.27 -1.27,-1.27
  pour Bottom: -2.54,91.44 66.04,91.44 66.04,-2.54 -2.54,-2.54
I2C_3V3
  Bottom 0.305: JP2.3 3.81,41.91 3.81,39.37 5.08,38.1 54.61,38.1 55.88,39.37 55.88,40.64 JP3.3
I2C_5V  (via drill 0.5)
  Top 0.305: 3.81,44.45 3.81,39.37
  Top 0.813: D1.A 2.54,52.26 JP2.1 3.81,44.45 | 3.81,39.37 v3.81,37.47
  Bottom 0.305: 59.69,39.37 59.69,44.45
  Bottom 0.813: v3.81,37.47 4.45,36.83 57.15,36.83 59.69,39.37 | 59.69,44.45 JP3.1
INT  (via drill 0.33)
  Top 0.254: U1.55 v31.65,53.34 31.65,53.24 v28.57,50.16 | JP2.6 6.35,40.64 9.31,43.6 R9.1 11.85,43.18 v20.95,43.18 SJ3.1 | JP3.6 59.69,41.91 57.15,41.91 v54.61,44.45
  Bottom 0.254: v20.95,43.18 21.59,43.18 v28.57,50.16 | v54.61,44.45 45.72,53.34 v31.65,53.34
LCD_D4
  Top 0.254: U1.50 29.15,56.45 35.56,62.87 JP1.D4
LCD_D5
  Top 0.254: U1.52 30.15,56.82 38.1,64.77 JP1.D5
LCD_D6
  Top 0.254: U1.53 30.65,56.69 40.64,66.67 JP1.D6
LCD_D7
  Top 0.254: U1.54 31.15,56.55 43.18,68.58 JP1.D7
LCD_EN  (via drill 0.33)
  Top 0.254: U1.49 28.65,60.25 v28.57,60.33
  Bottom 0.254: v28.57,60.33 28.57,67.94 23.5,73.03 23.5,74.93 22.86,75.56 JP1.E
LCD_LEDB
  Top 0.254: U2.12 46.73,61.97 50.8,66.04 R22.2
LCD_LEDB_RES
  Top 0.254: JP1.B 50.8,73.66 R22.1
LCD_LEDG
  Top 0.254: U2.13 46.08,61.95 48.26,64.14 R23.2
LCD_LEDG_RES
  Top 0.254: JP1.G 48.26,73.66 R23.1
LCD_LEDR
  Top 0.254: U2.14 45.42,61.94 46.99,63.5 46.99,68.58 45.72,69.85 R24.2
LCD_LEDR_RES
  Top 0.254: JP1.R 45.72,73.66 R24.1
LCD_R/W  (via drill 0.33)
  Top 0.254: U1.48 28.15,59.48 v27.94,59.69
  Bottom 0.254: v27.94,59.69 27.94,67.94 20.32,75.56 JP1.R/W
LCD_RS  (via drill 0.33)
  Top 0.254: U1.47 27.65,58.71 v27.3,59.05
  Bottom 0.254: v27.3,59.05 27.3,67.94 21.59,73.66 19.68,73.66 17.78,75.56 JP1.RS
LED_OE
  Top 0.254: U2.15 44.77,63.61 R21.1
OE
  Top 0.254: U1.30 19.15,55.78 19.05,55.88 16.73,55.88 R10.1
P0_0  (via drill 0.33)
  Top 0.254: U1.3 31.15,64.17 v34.29,67.31
  Bottom 0.254: v34.29,67.31 39.37,72.39 53.34,72.39 60.96,80.01 U$2.1
P0_1  (via drill 0.33)
  Top 0.254: U1.4 30.65,64.94 v34.29,68.58
  Bottom 0.254: v34.29,68.58 39.37,73.66 53.34,73.66 58.42,78.74 U$2.2
P0_2  (via drill 0.33)
  Top 0.254: U1.5 30.15,65.71 v34.29,69.85
  Bottom 0.254: v34.29,69.85 39.37,74.93 39.37,77.47 40.01,78.11 51.44,78.11 U$2.3
P0_3  (via drill 0.33)
  Top 0.254: U1.7 29.15,65.98 v34.29,71.12
  Bottom 0.254: v34.29,71.12 36.83,73.66 36.83,77.47 38.1,78.74 49.53,78.74 U$2.4
P0_4  (via drill 0.33)
  Top 0.254: U1.8 28.65,66.75 v34.29,72.39
  Bottom 0.254: v34.29,72.39 34.29,77.47 36.2,79.38 47.62,79.38 U$2.5
P0_5
  Top 0.254: U1.9 28.15,67.52 34.29,73.66 34.29,77.47 36.83,80.01 45.72,80.01 U$2.6
P0_6  (via drill 0.33)
  Top 0.254: U1.10 27.65,68.29 v31.75,72.39
  Bottom 0.254: v31.75,72.39 31.75,77.47 34.29,80.01 43.18,80.01 U$2.7
P0_7
  Top 0.254: U1.12 26.65,68.56 31.75,73.66 31.75,77.47 34.92,80.64 41.27,80.64 U$2.8
P1_0  (via drill 0.33)
  Top 0.254: U1.13 26.15,69.33 v29.21,72.39
  Bottom 0.254: v29.21,72.39 29.21,77.47 32.38,80.64 38.73,80.64 U$3.1
P1_1
  Top 0.254: U1.14 25.65,70.1 29.21,73.66 29.21,77.47 33.02,81.28 36.83,81.28 U$3.2
P1_2  (via drill 0.33)
  Top 0.254: U1.15 25.15,70.87 v26.67,72.39
  Bottom 0.254: v26.67,72.39 26.67,77.47 30.48,81.28 34.29,81.28 U$3.3
P1_3
  Top 0.254: U1.16 24.65,71.64 26.67,73.66 26.67,78.74 29.21,81.28 31.75,81.28 U$3.4
P1_4  (via drill 0.33)
  Top 0.254: U1.17 24.15,73.05 v25.4,74.3
  Bottom 0.254: v25.4,74.3 24.13,75.56 24.13,77.47 27.94,81.28 29.21,81.28 U$3.5
P1_5
  Top 0.254: U1.19 23.15,73.31 24.13,74.3 24.13,78.74 U$3.6
P1_6  (via drill 0.33)
  Top 0.254: U1.20 22.65,74.08 v22.86,74.3
  Bottom 0.254: v22.86,74.3 21.59,75.56 21.59,78.74 U$3.7
P1_7
  Top 0.254: U1.21 22.15,75 21.59,75.56 21.59,81.28 U$3.8
P2_0  (via drill 0.33)
  Top 0.254: U1.22 21.65,72.97 v20.32,74.3
  Bottom 0.254: v20.32,74.3 19.05,75.56 19.05,81.28 U$4.1
P2_1
  Top 0.254: U1.24 20.65,72.69 19.05,74.3 19.05,81.28 U$4.2
P2_2  (via drill 0.33)
  Top 0.254: U1.25 20.15,71.92 v19.68,72.39
  Bottom 0.254: v19.68,72.39 16.51,75.56 16.51,81.28 U$4.3
P2_3
  Top 0.254: U1.26 19.65,71.16 16.51,74.3 16.51,78.74 U$4.4
P2_4
  Top 0.254: U1.31 19.65,53.94 19.05,53.34 15.88,53.34 15.24,53.98 15.24,61.59 13.97,62.87 13.97,64.77 10.16,68.58 10.16,72.39 7.62,74.93 7.62,80.01 U$4.5
P2_5
  Top 0.254: U1.32 20.15,53.8 19.05,52.7 15.88,52.7 14.61,53.98 14.61,61.59 13.34,62.87 13.34,64.77 9.53,68.58 9.53,72.39 6.99,74.93 6.99,81.92 U$4.6
P2_6
  Top 0.254: U1.33 20.65,53.67 19.05,52.07 15.88,52.07 13.97,53.98 13.97,61.59 12.7,62.87 12.7,64.77 8.89,68.58 8.89,72.39 6.35,74.93 6.35,81.28 U$4.7
P2_7
  Top 0.254: U1.35 21.65,54.03 19.05,51.44 15.88,51.44 13.34,53.98 13.34,61.59 12.06,62.87 12.06,64.77 8.26,68.58 8.26,72.39 5.71,74.93 5.71,79.38 U$4.8
PLAY_BTN
  Top 0.254: R19.2 C8.1 25.82,25.82 U$12.9 U$11.9 30.48,45.09 29.21,46.35 24.13,46.35 22.15,48.34 U1.36
PLAY_BTN_RES
  Top 0.254: SW3.2 29.11,19.15 27.52,20.74 R19.1
PLAY_LED  (via drill 0.33)
  Top 0.254: U2.6 44.77,42.23 U$11.14 U$12.14 | v23.5,24.77 R17.2
  Bottom 0.254: v23.5,24.77 23.5,26.04 24.77,27.3 41.91,27.3 43.18,28.57 U$12.14
PLAY_LED_RES
  Top 0.254: R17.1 23.5,16.27 SW3.A
RESET
  Top 0.254: U1.56 34.02,54.76 R6.1
SCL  (via drill 0.33)
  Top 0.254: U2.18 42.83,63.85 v42.55,64.14 | JP8.3 55.34,65.5 v53.98,64.14 53.98,55.24 59.69,49.53 59.69,44.45 JP3.4 | v32.38,64.14 31.65,63.4 U1.2 31.65,60.86 v30.48,59.69 | JP2.4 9.31,47.41 R8.1 11.85,47.41 v12.7,48.26 SJ2.1
  Bottom 0.254: v53.98,64.14 v42.55,64.14 v32.38,64.14 | v12.7,48.26 12.7,51.44 18.41,57.15 24.77,57.15 25.4,57.78 28.57,57.78 v30.48,59.69
SDA  (via drill 0.33)
  Top 0.254: U2.19 42.17,62.6 v41.91,62.87 40.64,62.87 v40.01,63.5 | v33.66,63.5 33.02,63.5 32.15,62.63 U1.1 | JP2.2 5.08,46.99 9.31,51.22 R7.1 11.21,51.22 v11.43,51.44 SJ1.1
  Bottom 0.254: JP8.6 54.7,61.5 | 54.7,61.5 53.34,62.87 v41.91,62.87 | v40.01,63.5 v33.66,63.5 33.02,63.5 27.94,58.42 24.77,58.42 24.13,57.78 17.78,57.78 v11.43,51.44 | JP3.2 60.96,48.26 53.98,55.24 53.98,60.77 54.7,61.5
VO
  Top 0.254: 17.78,71.12 C10.1
  Top 0.305: JP1.VO 15.55,75.89 U3.1 16.48,72.42 17.78,71.12
WII_INT  (via drill 0.33)
  Top 0.254: U1.42 25.15,55.49 24.13,56.52 v23.5,56.52
  Bottom 0.254: JP8.5 41.27,63.5 34.92,57.15 v26.04,57.15 25.4,56.52 v23.5,56.52

### Text on the board
tPlace: 5V | 3V3 | GND | 5V | 3V3 | GND | 5V | 3V3 | GND | Port 2 | Port 1 | Port 0 | 5V | 3V3 | GND | VIN | VO | RS | R/W | CLK | NC | NC | NC | NC | D4 | D5 | D6 | D7 | BL+ | R- | G- | B- | GND | 5V | SmoothiePanel Beta | Prototype 1 | JP4 | designed by Logxen | 5V | SDA | I2C | 3V3 | SCL | Open=1/ / Closed=0 | GND | INT | GND | A0 | A1 | A2 | BUZZ | PLAY_ / BTN | BACK_ / BTN | ENC_A | ENC_B | ENC_ / BTN | PLAY_ / LED | BACK_ / LED | ENC_ / LEDR | ENC_ / LEDG | ENC_ / LEDB | 5V | 3V3 | GND | SDA | SCL | INT | GND | I2C | CUT HERE TO INSERT A CABLE OR TO REPLACE THE BUILT-IN INTERFACE PANEL | SmoothiePanel Beta | Prototype 1 | BUZZER | ENCODER | designed by Logxen | PLAY | BACK
bPlace: 5V | 3V3 | GND | 5V | 3V3 | GND | 5V | 3V3 | GND | Port 2 | Port 1 | Port 0 | GND | VIN | VO | RS | R/W | CLK | NC | NC | NC | NC | D4 | D5 | D6 | D7 | BL+ | R- | G- | B- | JP1 | GND | 5V | JP4 | http://github.com/logxen/SmoothiePanel | VIN | SmoothiePanel Beta | Prototype 1 | designed by Logxen | with the help of the | RepRap community | JP2 | JP3 | BUZZ | PLAY_ / BTN | BACK_ / BTN | ENC_A | ENC_B | ENC_ / BTN | PLAY_ / LED | BACK_ / LED | ENC_ / LEDR | ENC_ / LEDG | ENC_ / LEDB | 5V | 3V3 | GND | SDA | SCL | INT | GND | CUT HERE TO INSERT A CABLE OR TO REPLACE THE BUILT-IN INTERFACE PANEL